# Altium schematic sheet Medida tension.SchDoc
size A4
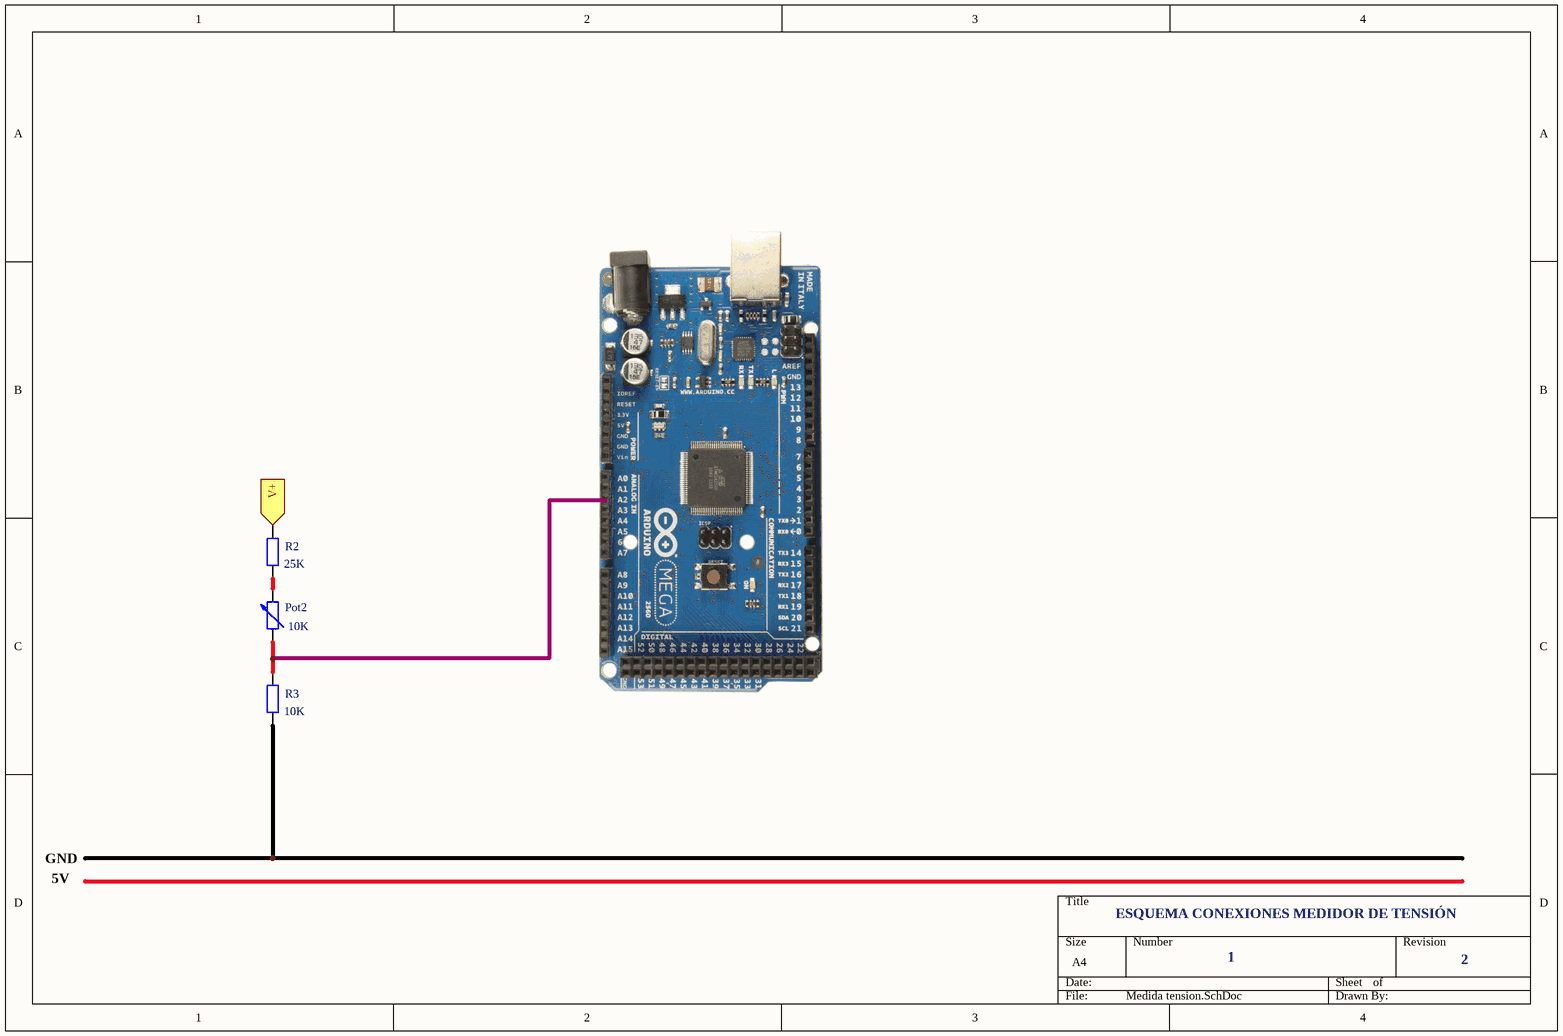
[diagram p0: Medida tension.SchDoc]

## Parts
Pot2  value 10K  [AXIAL-0.6]  (hidden comment: Res Adj2)
R2  value 25K  [AXIAL-0.4]  (hidden comment: Res2)
R3  value 10K  [AXIAL-0.4]  (hidden comment: Res2)

## Ports
V+

## Nets
V+: R2.2 ; port V+
NetPot2_1: Pot2.1 R3.2
NetPot2_2: Pot2.2 R2.1

Not connected (* = marked no-connect by the designer): R3 1

## Notes on the sheet
- GND
- 5V
- ESQUEMA CONEXIONES MEDIDOR DE TENSIÓN
- 1
- 2

## Library data of the parts
Pot2 = Res Adj2: Variable Resistor; Set Position: 0.5; Published: 8-Jun-2000; LatestRevisionDate: 17-Jul-2002; LatestRevisionNote: Re-released for DXP Platform.; PackageReference: AXIAL-0.6; Publisher: Altium Limited; PackageDescription: Axial Device, Thru-Hole; 2 Leads; 0.6 in Pin Spacing
R2 R3 = Res2: Resistor; Published: 8-Jun-2000; LatestRevisionDate: 17-Jul-2002; LatestRevisionNote: Re-released for DXP Platform.; PackageReference: AXIAL-0.4; Publisher: Altium Limited; PackageDescription: Axial Device, Thru-Hole; 2 Leads; 0.4 in Pin Spacing